# EAGLE design LabPower-PWM (EAGLE 7.6.0)
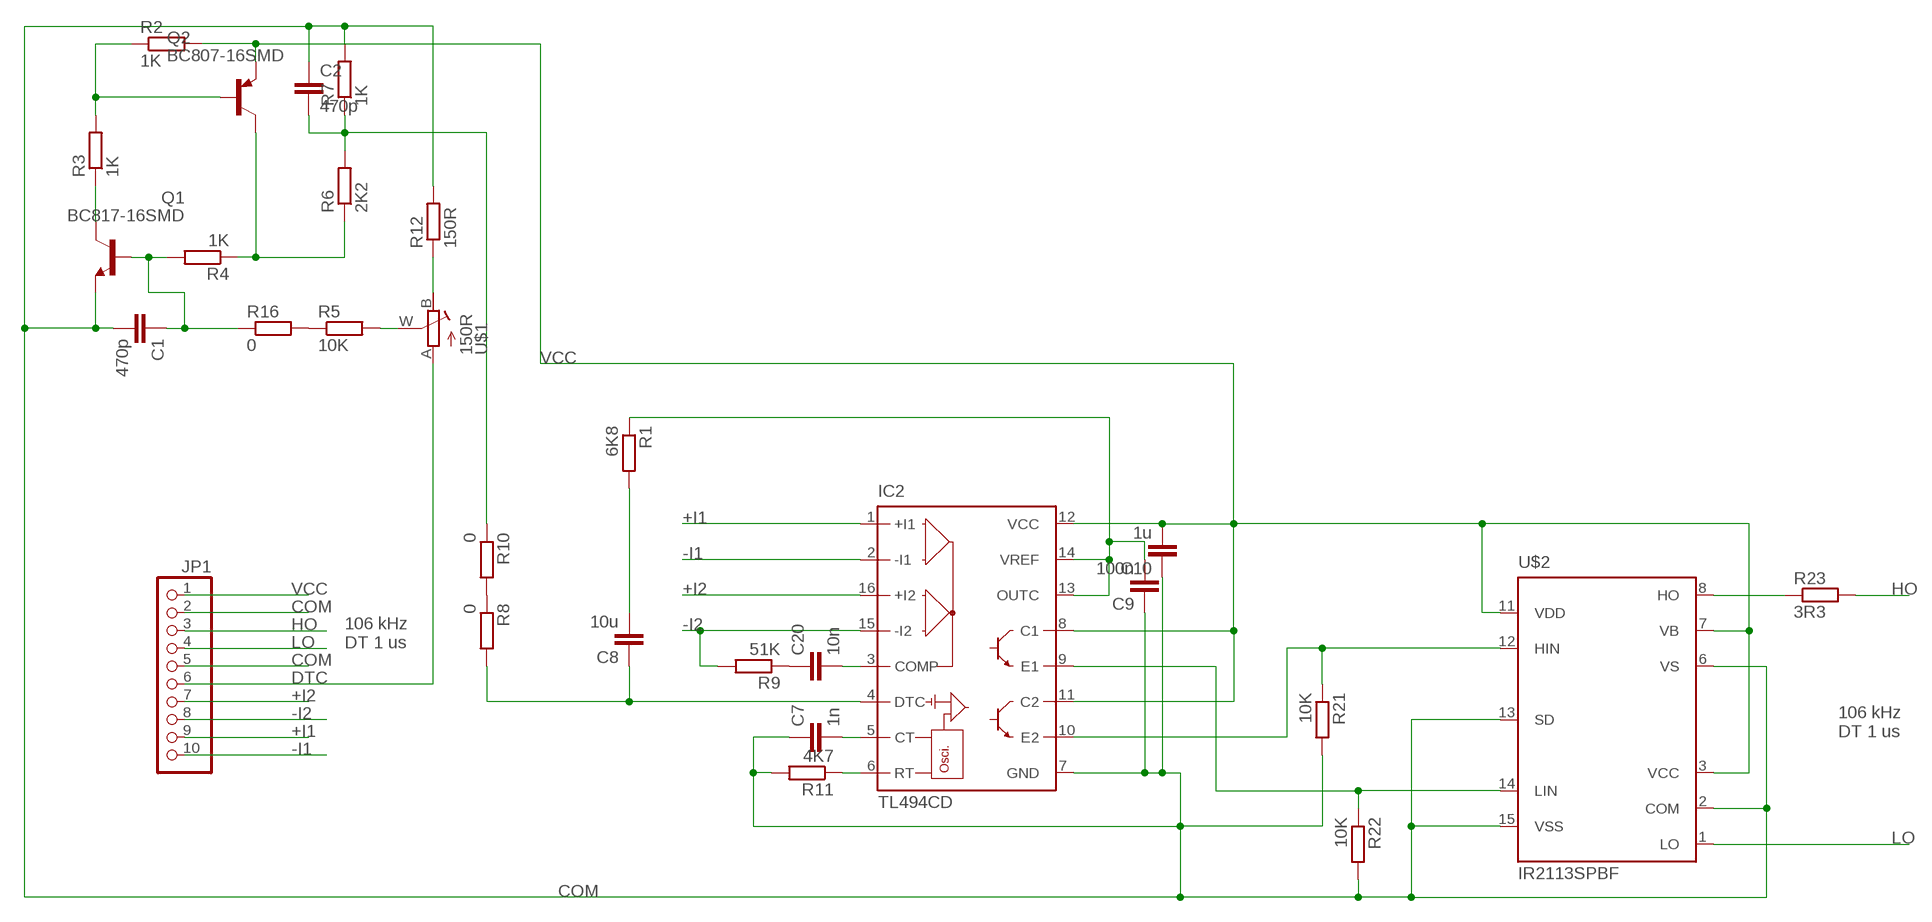
[diagram p0: schematic, sheet 1]

## Parts
C1  470p  C-EUC0805  [C0805]
C2  470p  C-EUC0805  [C0805]
C7  1n  C-EUC0805  [C0805]
C8  10u  C-EUC0805  [C0805]
C9  100n  C-EUC0805  [C0805]
C10  1u  C-EUC0805  [C0805]
C20  10n  C-EUC0805  [C0805]
IC2  TL494CD  [SO16]
JP1  PINHD-1X10  [1X10]
Q1  BC817-16SMD  [SOT23-BEC]
Q2  BC807-16SMD  [SOT23-BEC]
R1  6K8  R-EU_R0805  [R0805]
R2  1K  R-EU_R0805  [R0805]
R3  1K  R-EU_R0805  [R0805]
R4  1K  R-EU_R0805  [R0805]
R5  10K  R-EU_R0805  [R0805]
R6  2K2  R-EU_R0805  [R0805]
R7  1K  R-EU_R0805  [R0805]
R8  0  R-EU_R0805  [R0805]
R9  51K  R-EU_R0805  [R0805]
R10  0  R-EU_R0805  [R0805]
R11  4K7  R-EU_R0805  [R0805]
R12  150R  R-EU_R0805  [R0805]
R16  0  R-EU_R0805  [R0805]
R21  10K  R-EU_R0805  [R0805]
R22  10K  R-EU_R0805  [R0805]
R23  3R3  R-EU_R0805  [R0805]
U$1  150R  POTTURN-X  [RJ9W]
U$2  IR2113SPBF  [SO16W]

## Nets
1: C8.1 IC2.4(DTC) R8.2
+I1: IC2.1(+I1) JP1.9
+I2: IC2.16(+I2) JP1.7
-I1: IC2.2(-I1) JP1.10
-I2: IC2.15(-I2) JP1.8 R9.2
COM: C1.2 C2.1 C7.1 C9.1 C10.1 IC2.7(GND) JP1.2 JP1.5 Q1.E R7.2 R11.2 R12.2 R21.2 R22.2 U$2.2(COM) U$2.6(VS) U$2.13(SD) U$2.15(VSS)
DTC: JP1.6 U$1.A
HO: JP1.3 R23.2
LO: JP1.4 U$2.1(LO)
N$1: C8.2 R1.2
N$2: R5.2 U$1.W(S)
N$3: Q2.B R2.1 R3.2
N$4: R23.1 U$2.8(HO)
N$5: Q1.C R3.1
N$6: C1.1 Q1.B R4.2 R16.1
N$7: Q2.C R4.1 R6.1
N$8: C9.2 IC2.13(OUTC) IC2.14(VREF) R1.1
N$9: R12.1 U$1.B(E)
N$10: R5.1 R16.2
N$11: C20.1 R9.1
N$12: C20.2 IC2.3(COMP)
N$13: C2.2 R6.2 R7.1 R10.1
N$14: IC2.6(RT) R11.1
N$15: R8.1 R10.2
N$16: C7.2 IC2.5(CT)
N$25: IC2.10(E2) R21.1 U$2.12(HIN)
N$29: IC2.9(E1) R22.1 U$2.14(LIN)
VCC: C10.2 IC2.8(C1) IC2.11(C2) IC2.12(VCC) JP1.1 Q2.E R2.2 U$2.3(VCC) U$2.7(VB) U$2.11(VDD)

## Notes on the sheet
- 106 kHz
  DT 1 us
- 106 kHz
  DT 1 us

## Library data of the parts
C1 C2 C7-C10 C20 = rcl:C-EU: CAPACITOR, European symbol
IC2 = linear:TL494*: SWITCHMODE Pulse Width Modulation Control Circuit NCV494B http://onsemi.com tl494-d.pdf
JP1 = pinhead:PINHD-1X10: PIN HEADER
Q1 = transistor-npn:BC817*: NPN Transistor
Q2 = transistor-pnp:BC807*: PNP Transistror
R1-R12 R16 R21-R23 = rcl:R-EU_: RESISTOR, European symbol
U$1 = Namenlos:POT
U$2 = Namenlos:IR2113SPBF

## Net classes
0 default: clearance 0.205 mm

## Board
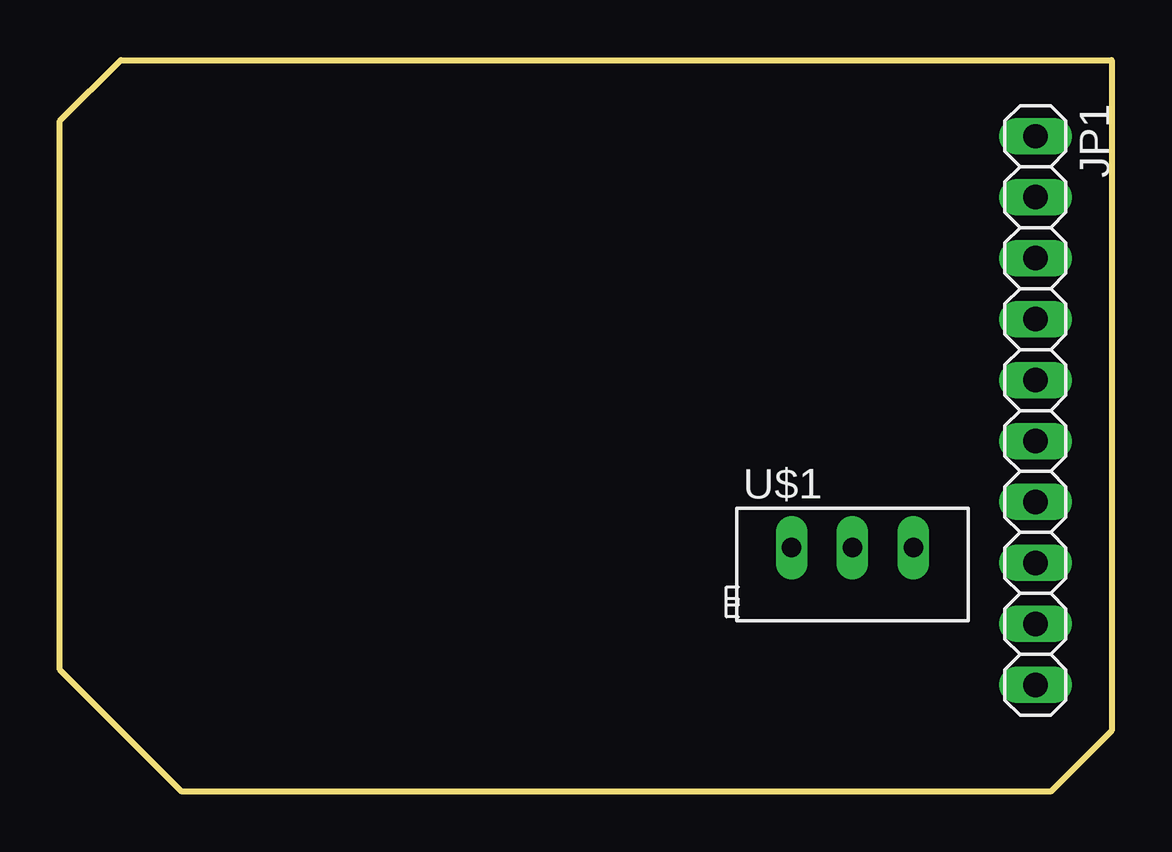
[diagram p1: board, top side]
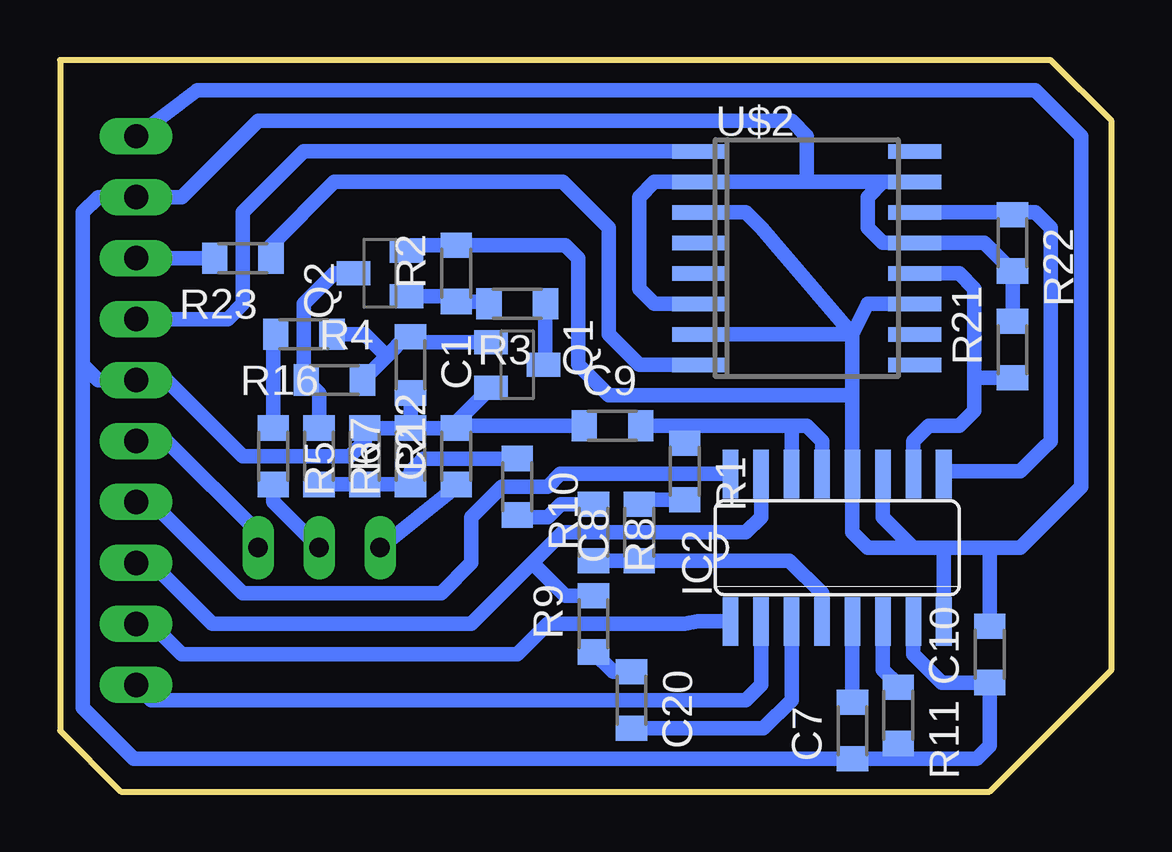
[diagram p2: board, bottom side, seen from below]

Size 43.81 x 30.48 mm. Coordinates in mm from the lower left corner, seen from the top.
Outline: 2.54,30.48 43.81,30.48 43.81,2.54 41.27,0 5.08,0 0,5.08 0,27.94 2.54,30.48
Copper layers (1*16): Top 0.035mm / dielectric 1.5mm / Bottom 0.035mm
Design rules "default *": minimum track width 10mil, minimum drill 24mil, track to track 8mil, track to pad 8mil, pad to pad 8mil, via to via 8mil, smd to smd 8mil, copper to edge 40mil, drill to drill 8mil, minimum pad ring 10mil, minimum via ring 8mil, stop-mask expansion 4mil, vias tented up to drill 0mil, thermal gap 10mil

### Footprints (pad centres in the part's own frame; a part is rotated, then mirrored left to right if it is on the bottom)
C0805 = smd 1.05 x 1.3: 1 -1.175,0; 2 1.175,0
SO16 = smd 0.66 x 2.032: 1 -4.445,-3.073; 2 -3.175,-3.073; 3 -1.905,-3.073; 4 -0.635,-3.073; 5 0.635,-3.073; 6 1.905,-3.073; 7 3.175,-3.073; 8 4.445,-3.073; 9 4.445,3.073; 10 3.175,3.073; 11 1.905,3.073; 12 0.635,3.073; 13 -0.635,3.073; 14 -1.905,3.073; 15 -3.175,3.073; 16 -4.445,3.073
1X10 = drill 1.016 long: 1 -11.43,0; 2 -8.89,0; 3 -6.35,0; 4 -3.81,0; 5 -1.27,0; 6 1.27,0; 7 3.81,0; 8 6.35,0; 9 8.89,0; 10 11.43,0
SOT23-BEC = smd 1 x 1.4: B -0.95,-1.1; C 0,1.1; E 0.95,-1.1
R0805 = smd 1.05 x 1.3: 1 -1.175,0; 2 1.175,0
RJ9W = drill 0.813 long: A 2.54,0.635; B -2.54,0.635; W 0,0.635
SO16W = smd 0.6 x 2.2: 1 -4.445,-4.505; 2 -3.175,-4.505; 3 -1.905,-4.505; 4 -0.635,-4.505; 5 0.635,-4.505; 6 1.905,-4.505; 7 3.175,-4.505; 8 4.445,-4.505; 9 4.445,4.505; 10 3.175,4.505; 11 1.905,4.505; 12 0.635,4.505; 13 -0.635,4.505; 14 -1.905,4.505; 15 -3.175,4.505; 16 -4.445,4.505

### Placement (x,y rotation side)
C1  29.21,17.78 270 bottom
C2  31.11,13.97 270 bottom
C7  10.79,2.54 90 bottom
C8  19.68,10.8 90 bottom
C9  20.8,15.24 0 bottom
C10  5.08,5.71 90 bottom
C20  20,3.81 270 bottom
IC2  11.43,10.16 0 bottom
JP1  40.64,15.88 270 top
Q1  24.77,17.78 270 bottom
Q2  30.48,21.59 90 bottom
R1  17.78,13.34 270 bottom
R2  27.3,21.59 90 bottom
R3  24.77,20.32 180 bottom
R4  32.38,17.14 0 bottom
R5  34.92,13.97 270 bottom
R6  33.02,13.97 270 bottom
R7  29.21,13.97 90 bottom
R8  21.59,10.8 270 bottom
R9  21.59,6.98 90 bottom
R10  24.77,12.7 270 bottom
R11  8.89,3.18 270 bottom
R12  27.3,13.97 90 bottom
R16  33.66,19.05 180 bottom
R21  4.13,18.41 90 bottom
R22  4.13,22.86 270 bottom
R23  36.2,22.23 180 bottom
U$1  33.02,9.53 0 top
U$2  12.7,22.23 270 bottom

### Tracks (layer width: path | path; a pad name or v marks a point on that pad's centre or on a via)
1
  Bottom 0.61: IC2.4 12.06,8.25 13.43,9.62 C8.1 R8.2
+I1
  Bottom 0.61: IC2.1 17.25,7.09 17.78,6.98 23.49,6.98 24.77,5.71 38.73,5.71 40,6.98 JP1.9
+I2
  Bottom 0.61: JP1.7 40,12.07 36.2,8.25 27.94,8.25 26.67,9.53 26.67,11.43 25.4,12.7 23.49,12.7 22.96,13.23 IC2.16
-I1
  Bottom 0.61: IC2.2 14.6,4.45 15.24,3.81 40,3.81 JP1.10
-I2
  Bottom 0.61: IC2.15 14.6,11.43 15.24,10.8 22.86,10.8 24.13,9.53 | 24.13,9.53 26.67,6.98 37.46,6.98 40,9.53 JP1.8 | R9.2 22.77,8.16 24.13,9.53
COM
  Bottom 0.61: U$2.6 19.05,20.32 19.68,20.95 19.68,24.77 19.05,25.4 U$2.2 12.7,25.4 | 42.86,17.78 42.86,24.13 42.23,24.77 JP1.2 38.73,24.77 35.56,27.94 13.33,27.94 12.7,27.3 12.7,25.4 | 42.86,17.78 42.23,17.14 JP1.5 39.37,17.14 36.2,13.97 31.75,13.97 31.11,14.61 C2.1 R7.2 | U$2.15 9.52,25.4 | 9.52,25.4 10.16,24.77 10.16,23.5 9.52,22.86 U$2.13 5.3,22.86 R22.2 R21.2 | 12.7,25.4 9.52,25.4 | 42.86,17.78 42.86,3.49 40.73,1.37 C7.1 8.89,1.37 | IC2.7 8.25,5.71 7.08,4.54 C10.1 5.08,1.91 5.62,1.37 8.89,1.37 | R12.2 R7.2 | Q1.E 27.3,15.39 R12.2 | C1.2 R7.2 | C9.1 27.3,15.24 R12.2 | R11.2 8.89,1.37
DTC
  Bottom 0.61: U$1.A 35.56,10.8 39.37,14.61 JP1.6
HO
  Bottom 0.61: R23.2 JP1.3
LO
  Bottom 0.61: U$2.1 33.66,26.67 36.2,24.13 36.2,20.32 36.83,19.69 JP1.4
N$1
  Bottom 0.61: R1.2 19.49,12.16 C8.2
N$2
  Bottom 0.61: U$1.W 34.92,12.07 R5.2
N$3
  Bottom 0.61: R3.2 26.03,20.41 R2.1 27.53,20.64 Q2.B
N$4
  Bottom 0.61: U$2.8 19.68,17.78 20.95,19.05 20.95,23.5 22.86,25.4 32.38,25.4 35.02,22.77 R23.1
N$5
  Bottom 0.61: Q1.C 23.59,17.86 R3.1
N$6
  Bottom 0.61: Q1.B 28.98,18.73 C1.1 29.4,18.95 30.21,18.14 | 30.21,18.14 R4.2 | R16.1 31.11,19.05 30.21,18.14
N$7
  Bottom 0.61: R6.1 33.02,16.61 R4.1 33.66,17.24 33.66,20.32 32.38,21.59 Q2.C
N$8
  Bottom 0.61: IC2.14 13.33,15.24 | IC2.13 12.06,14.61 12.7,15.24 13.33,15.24 | 13.33,15.24 17.78,15.24 | 17.78,15.24 C9.2 | R1.1 17.78,15.24
N$9
  Bottom 0.61: R12.1 27.3,12.7 U$1.B
N$10
  Bottom 0.61: R5.1 34.92,18.95 R16.2
N$11
  Bottom 0.61: C20.1 20.77,4.98 R9.1
N$12
  Bottom 0.61: C20.2 14.51,2.64 13.33,3.81 IC2.3
N$13
  Bottom 0.61: R6.2 C2.2 R7.1 29.21,13.34 28.67,13.88 R10.1
N$14
  Bottom 0.61: R11.1 8.89,4.45 9.52,5.08 IC2.6
N$15
  Bottom 0.61: R8.1 22.95,11.97 23.49,11.43 24.67,11.43 R10.2
N$16
  Bottom 0.61: C7.2 IC2.5
N$25
  Bottom 0.61: IC2.10 8.25,14.61 7.62,15.24 6.35,15.24 5.71,15.88 5.71,17.14 | 5.71,17.14 5.71,20.95 6.35,21.59 U$2.12 | R21.1 5.62,17.24 5.71,17.14
N$29
  Bottom 0.61: U$2.14 4.44,24.13 | 4.44,24.13 3.17,24.13 2.54,23.5 2.54,14.61 2.86,14.29 3.81,13.34 6.88,13.34 IC2.9 | R22.1 4.44,24.13
VCC
  Bottom 0.61: JP1.1 38.1,29.21 3.17,29.21 1.27,27.3 1.27,12.7 3.81,10.16 5.08,10.16 | 5.08,10.16 6.98,10.16 | 6.98,10.16 8.25,10.16 | 8.25,10.16 9.52,11.43 IC2.11 | 8.25,10.16 10.16,10.16 10.79,10.8 IC2.12 10.79,16.51 | IC2.8 6.98,10.16 | U$2.7 10.79,19.05 | 10.79,19.05 10.79,16.51 | U$2.3 15.24,24.13 14.6,23.5 10.79,19.05 | U$2.11 10.16,20.32 10.79,19.05 | C10.2 5.08,10.16 | Q2.E 29.15,22.77 R2.2 22.77,22.77 22.22,22.23 22.22,17.78 20.95,16.51 10.79,16.51